# Altium schematic sheet XM-15B Typical Application Circuit.SchDoc: XM-15B Bluetooth Module Typical Application Circuit
size A
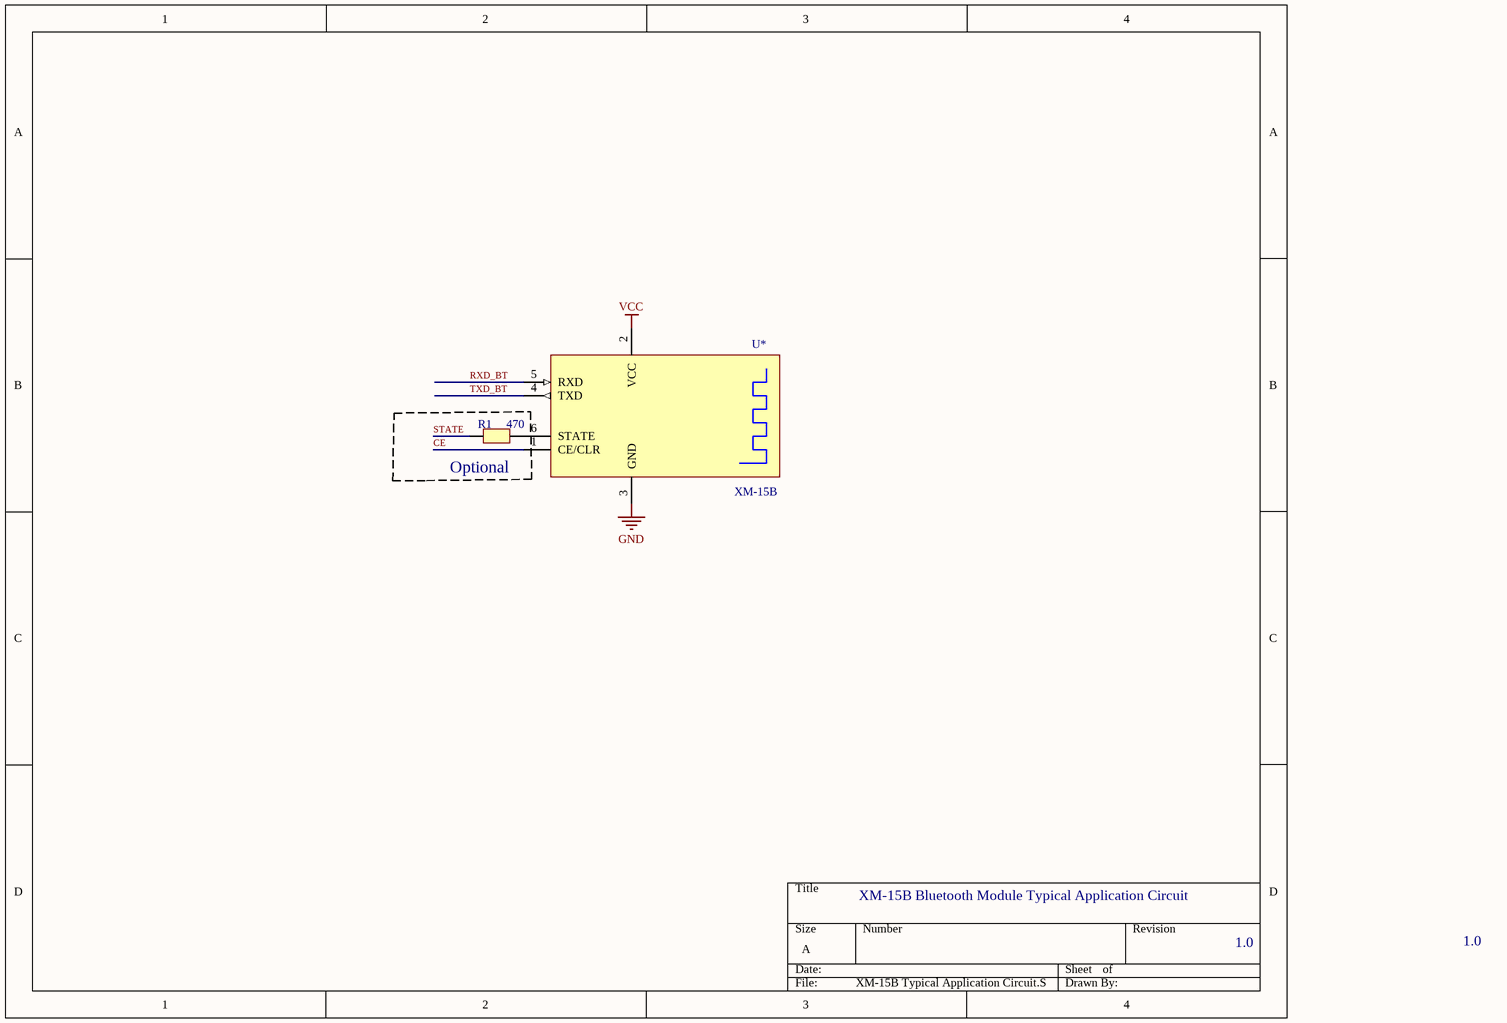
[diagram p0: XM-15B Typical Application Circuit.SchDoc]

## Parts
R1  470  [0603.RC]
U*  XM-15B  [XM-05]

## Blocks framed on the sheet
Optional: R1

## Nets
GND: U*.3(GND)
VCC: U*.2(VCC)
CE: U*.1(CE/CLR)
RXD_BT: U*.5(RXD)
STATE: R1.2
TXD_BT: U*.4(TXD)
NetR1_1: R1.1 U*.6(STATE)

## Notes on the sheet
- 1.0

## Library data of the parts
R1 = RES